# EasyEDA Pro project 高速USB.epro

# Schematic Schematic1

## Sheets
1 P1: Board Name: Board1; Create Date: 2025-02-11; Page Name: P1; Project Name: 高速USB; Schematic Name: Schematic1; Update Date: 2025-02-21; Company: 嘉立创EDA; Page Size: A4; Version: V1.0
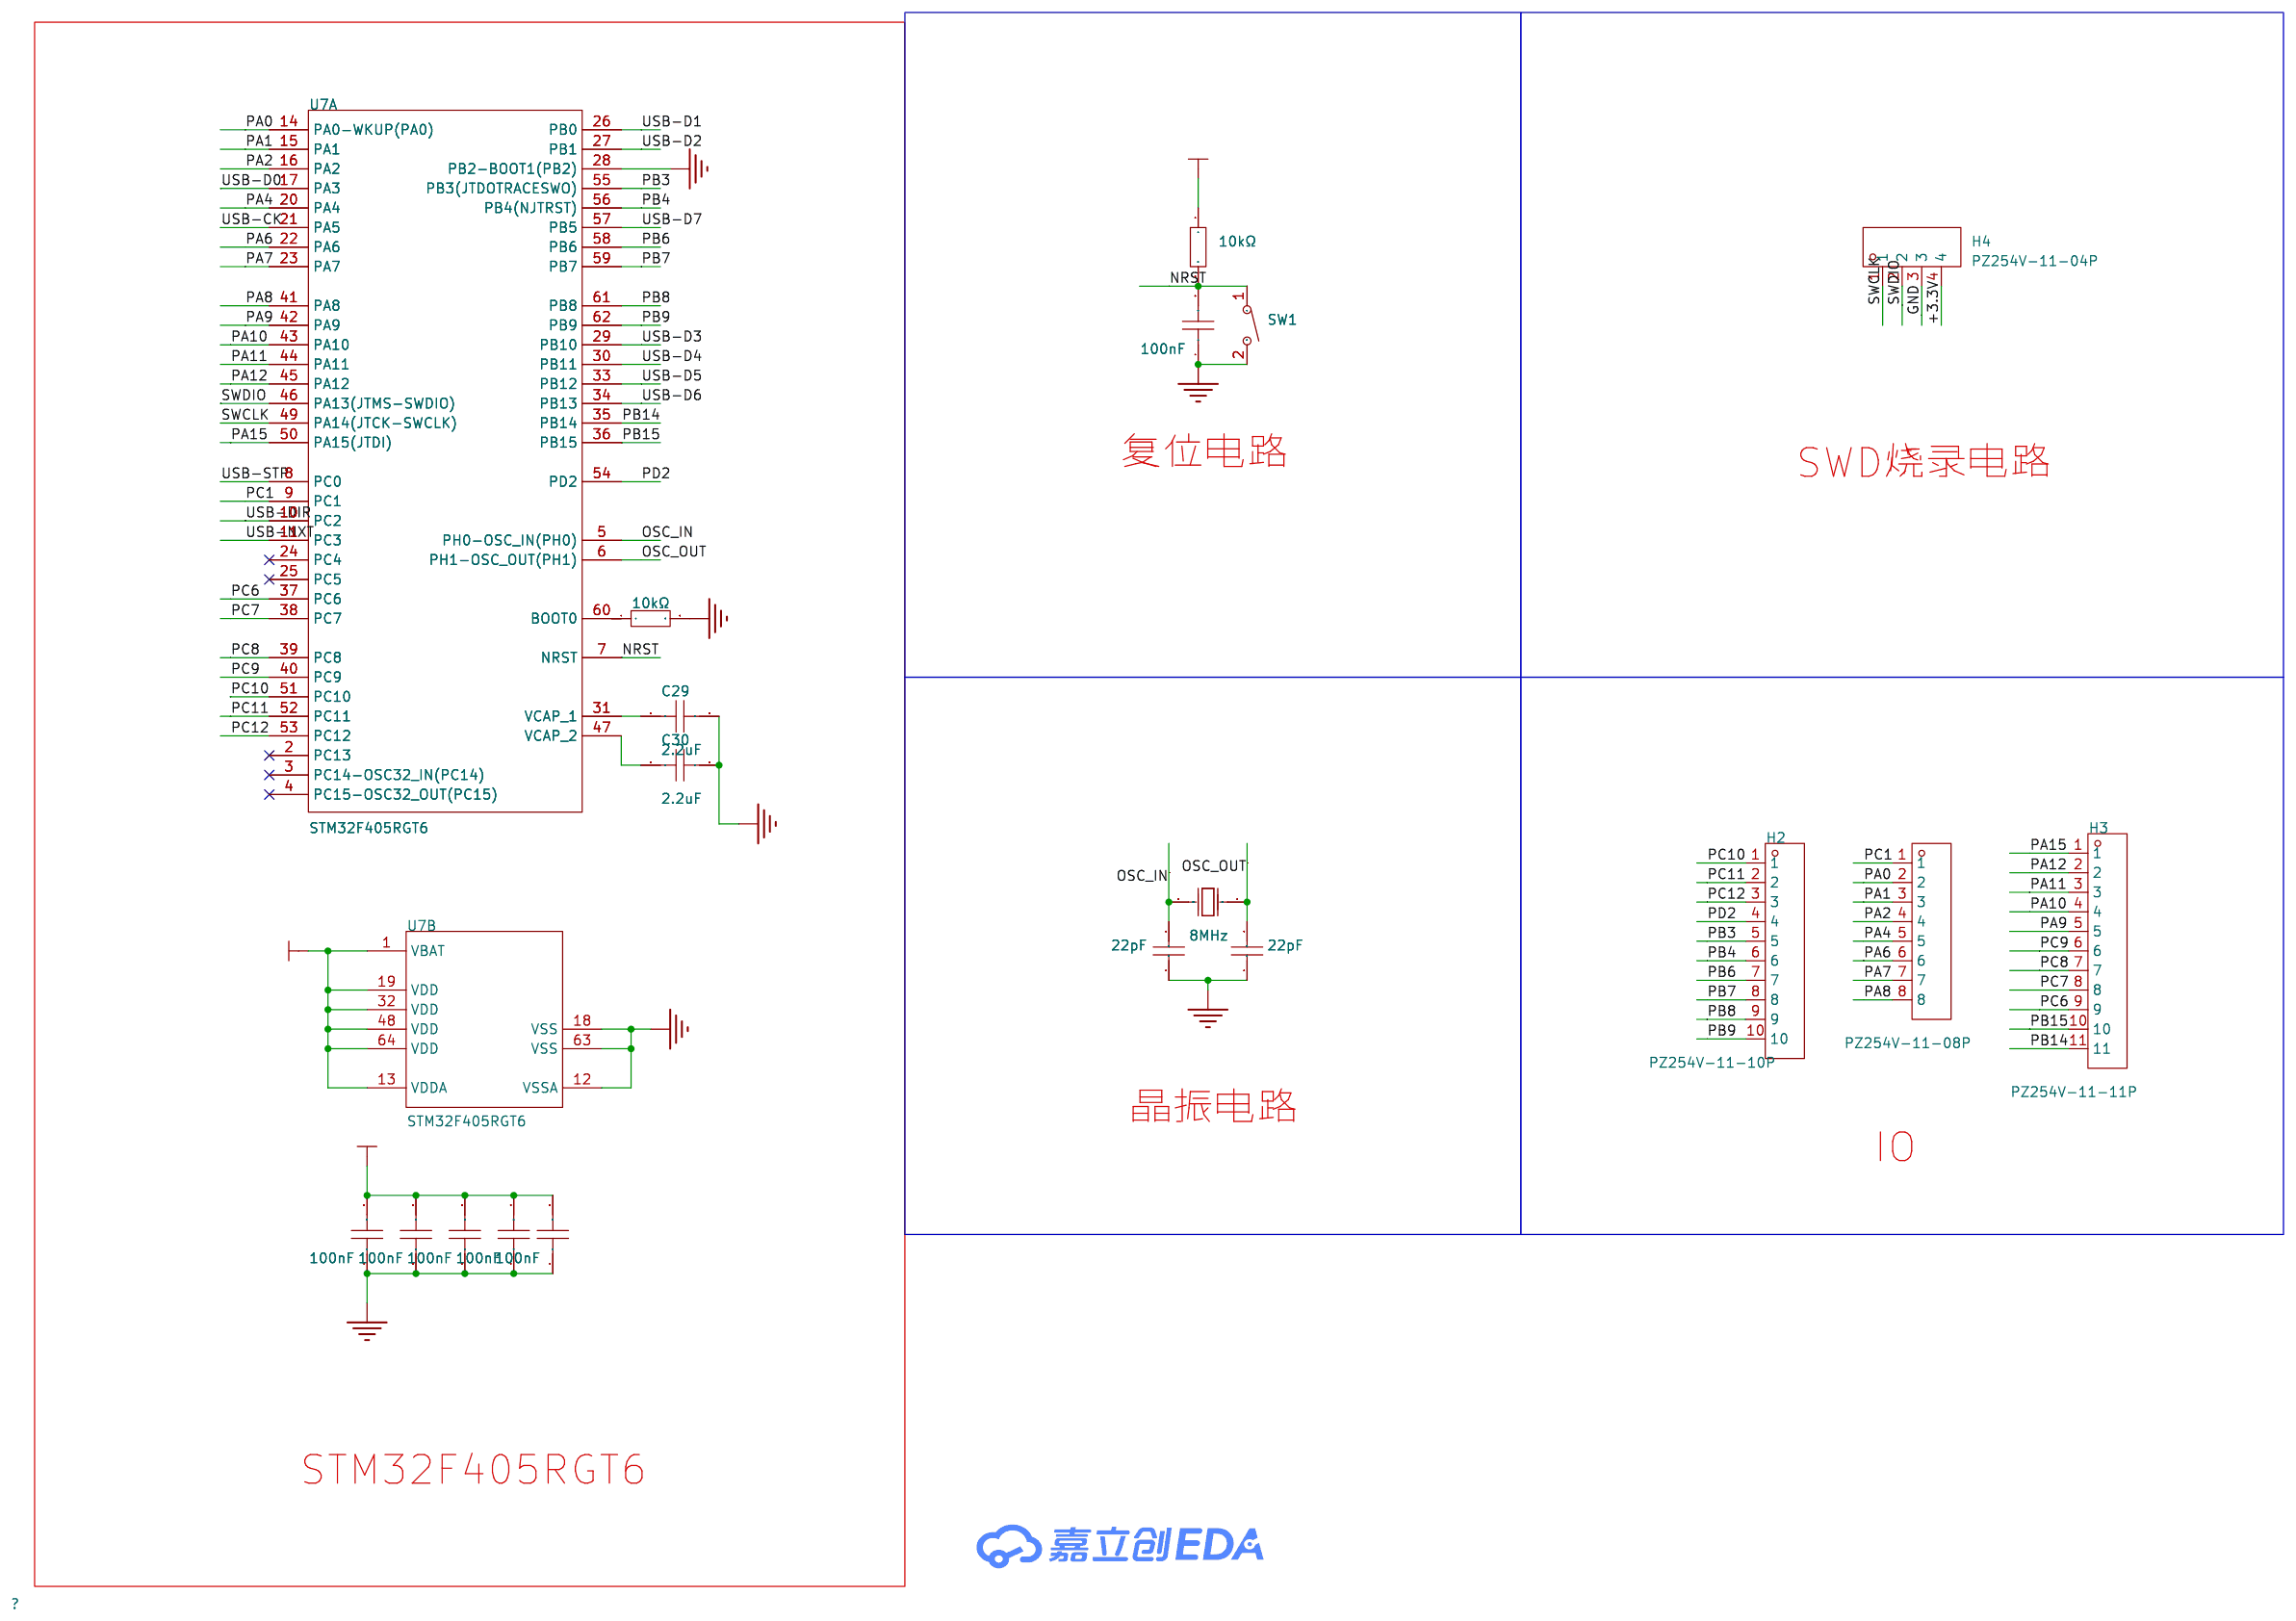
[diagram p0: P1]
2 P2: Page Name: P2
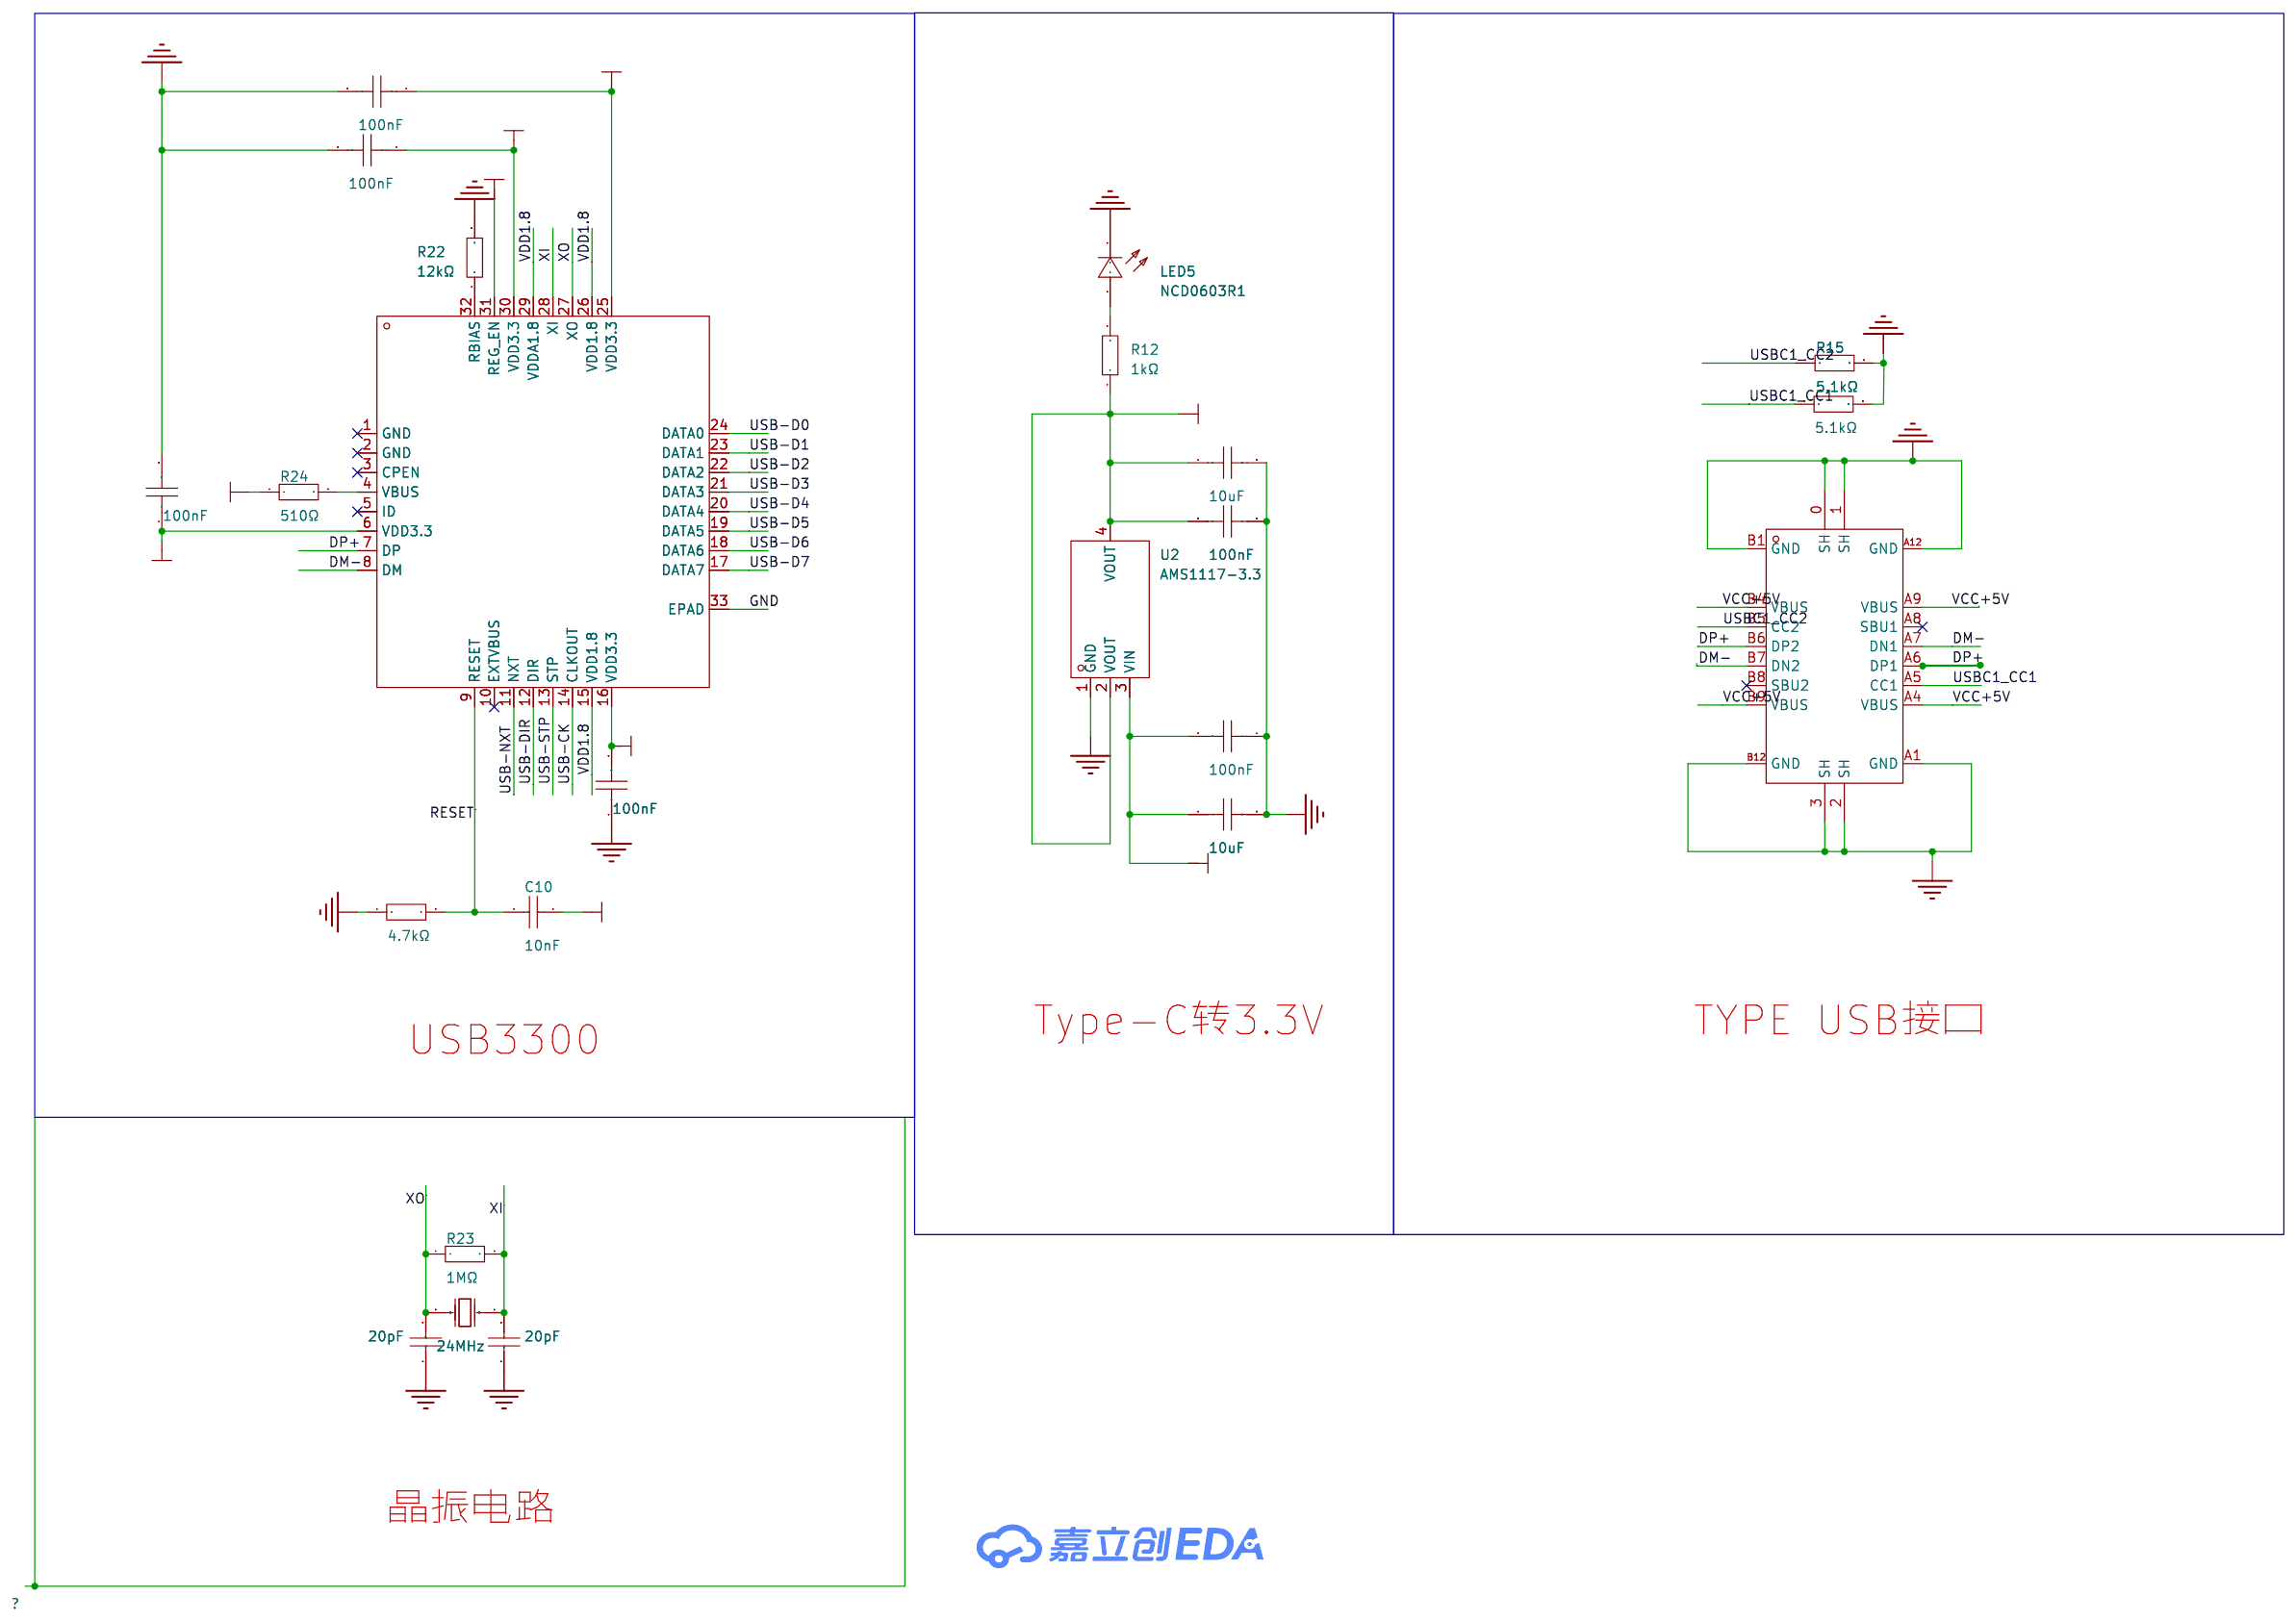
[diagram p1: P2]

## Parts
sheet P1
C20  22pF  [C0603]
C21  22pF  [C0603]
C22  100nF  [C0603]
C29  2.2uF  [C0603]
C30  2.2uF  [C0603]
C35  100nF  [C0603]
C36  100nF  [C0603]
C37  100nF  [C0603]
C38  100nF  [C0603]
C39  100nF  [C0603]
H1  PZ254V-11-08P  [HDR-TH_8P-P2.54-V-M]
H2  PZ254V-11-10P  [HDR-TH_10P-P2.54-V-M]
H3  PZ254V-11-11P  [HDR-TH_11P-P2.54-V-M]
H4  PZ254V-11-04P  [HDR-TH_4P-P2.54-V-M]
R18  10kΩ  [R0603]
R19  10kΩ  [R0603]
SW1  TS-1092S-B3D2-G  [SW-SMD_L6.1-W3.6-LS7.9]
U7  STM32F405RGT6  [LQFP-64_L10.0-W10.0-P0.50-LS12.0-BL]  (sections 1,2)
X3  8MHz  [OSC-SMD_L5.0-W3.2]
sheet P2
C10  10nF  [C0603]
C11  10uF  [C0603]
C12  100nF  [C0603]
C13  100nF  [C0603]
C14  10uF  [C0603]
C23  20pF  [C0603]
C24  20pF  [C0603]
C31  100nF  [C0603]
C32  100nF  [C0603]
C33  100nF  [C0603]
C34  100nF  [C0603]
LED5  NCD0603R1  [LED0603-RD_RED]
R11  4.7kΩ  [R0603]
R12  1kΩ  [R0603]
R14  5.1kΩ  [R0603]
R15  5.1kΩ  [R0603]
R22  12kΩ  [R0603]
R23  1MΩ  [R0603]
R24  510Ω  [R0603]
U2  AMS1117-3.3  [SOT-223-3_L6.5-W3.4-P2.30-LS7.0-BR]
USB3301  USB3300-EZK-TR  [QFN-32_L5.0-W5.0-P0.50-BL-EP3.4]
USBC2  TYPE-C-31-M-12  [USB-C_SMD-TYPE-C-31-M-12]
X4  24MHz  [HC-49US_L11.5-W4.5-P4.88]

## Library data of the parts
C20 C21 = CL10C220JB8NNNC: 容值:22pF;精度:±5%;额定电压:50V;材质(温度系数):C0G;; LCSC Part Name: 22pF ±5% 50V; Supplier Part: C1653; Manufacturer: SAMSUNG(三星); Supplier Footprint: 0603; Datasheet: https://atta.szlcsc.com/upload/public/pdf/source/20160218/1457707763339.pdf; Supplier: LCSC; Tolerance: ±5%; Voltage Rated: 50V; Temperature Coefficient: C0G
C12 C13 C22 C31-C39 = CGA0603X7R104K500JT: 容值:100nF;精度:±10%;额定电压:50V;材质(温度系数):X7R;; LCSC Part Name: 100nF ±10% 50V; Supplier Part: C6119867; Manufacturer: HRE(芯声); Supplier Footprint: 0603; Supplier: LCSC; Tolerance: ±10%; Voltage Rated: 50V; Temperature Coefficient: X7R
C29 C30 = CL10A225KB8NNNC: 容值:2.2uF;精度:±10%;额定电压:50V;材质(温度系数):X5R;; LCSC Part Name: 2.2uF ±10% 50V; Supplier Part: C913904; Manufacturer: SAMSUNG(三星); Supplier Footprint: 0603; JLCPCB Part Class: 扩展库; Datasheet: https://atta.szlcsc.com/upload/public/pdf/source/20160218/1457707763339.pdf; Supplier: LCSC; Tolerance: ±10%; Voltage Rated: 50V; Temperature Coefficient: X5R
H1 = PZ254V-11-08P: 插针结构:1x8P;间距:2.54mm;行距:-;圆针/方针:方针;安装类型:直插;排数:单排;总PIN位数:8P;额定电流:-;额定电压:-;配合针长度:6mm;塑高:2.5mm;端接针长度:3mm;触头材质:黄铜;触头镀层:-;工作温度范围:-40℃~+105℃;颜色:黑色;; LCSC Part Name: 间距:2.54mm 1x8P 直插 方针; Supplier Part: C492407; Manufacturer: XFCN(兴飞); Supplier Footprint: 插件,P=2.54mm; Datasheet: https://atta.szlcsc.com/upload/public/pdf/source/20200309/C492407_83A6FB26A2233368EDB9516968EC6149.pdf; Supplier: LCSC; Pin Structure: 1x8P; Pitch: 2.54mm; Circluar Pins/Square Pins: 方针; Mounting Type: 直插; Number of Rows: 单排; Number of Pins: 8P; Length of Mating Pin: 6mm; Insulation Height: 2.5mm; Length of End Connection Pin: 3mm; Contact Material: 黄铜; Operating Temperature Range: -40℃~+105℃; Color: 黑色
H2 = PZ254V-11-10P: 插针结构:1x10P;间距:2.54mm;行距:-;圆针/方针:方针;安装类型:直插;排数:单排;总PIN位数:10P;额定电流:-;额定电压:-;配合针长度:6mm;塑高:2.5mm;端接针长度:3mm;触头材质:黄铜;触头镀层:-;工作温度范围:-40℃~+105℃;颜色:黑色;; LCSC Part Name: 间距:2.54mm 1x10P 直插 方针; Supplier Part: C492409; Manufacturer: XFCN(兴飞); Supplier Footprint: 插件,P=2.54mm; Datasheet: https://atta.szlcsc.com/upload/public/pdf/source/20200309/C492409_129C9431BDD62EBBBD0A643B6AAB9FBD.pdf; Supplier: LCSC; Pin Structure: 1x10P; Pitch: 2.54mm; Circluar Pins/Square Pins: 方针; Mounting Type: 直插; Number of Rows: 单排; Number of Pins: 10P; Length of Mating Pin: 6mm; Insulation Height: 2.5mm; Length of End Connection Pin: 3mm; Contact Material: 黄铜; Operating Temperature Range: -40℃~+105℃; Color: 黑色
H3 = PZ254V-11-11P: 插针结构:1x11P;间距:2.54mm;行距:-;圆针/方针:方针;安装类型:直插;排数:单排;总PIN位数:11P;额定电流:3A;额定电压:250V;配合针长度:6mm;塑高:2.5mm;端接针长度:3mm;触头材质:-;工作温度范围:-40℃~+105℃;颜色:黑色;; LCSC Part Name: 间距:2.54mm 1x11P 直插 方针; Supplier Part: C2840011; Manufacturer: XFCN(兴飞); Supplier Footprint: 插件,P=2.54mm; Datasheet: https://atta.szlcsc.com/upload/public/pdf/source/20200309/C492403_F9F19131791D08044AD4F84F8E751A34.pdf; Supplier: LCSC; Pin Structure: 1x11P; Pitch: 2.54mm; Circluar Pins/Square Pins: 方针; Mounting Type: 直插; Number of Rows: 单排; Number of Pins: 11P; Current Rating (Max): 3A; Voltage Rating (Max): 250V; Length of Mating Pin: 6mm; Insulation Height: 2.5mm; Length of End Connection Pin: 3mm; Operating Temperature Range: -40℃~+105℃; Color: 黑色
H4 = PZ254V-11-04P: 插针结构:1x4P;间距:2.54mm;行距:-;圆针/方针:方针;安装类型:直插;排数:单排;总PIN位数:4P;额定电流:3A;额定电压:250V;配合针长度:6mm;塑高:2.5mm;端接针长度:3mm;触头材质:-;工作温度范围:-40℃~+105℃;颜色:黑色;; LCSC Part Name: 间距:2.54mm 1x4P 直插 方针; Supplier Part: C2691448; Manufacturer: XFCN(兴飞); Supplier Footprint: 插件,P=2.54mm; JLCPCB Part Class: 扩展库; Datasheet: https://atta.szlcsc.com/upload/public/pdf/source/20200309/C492403_F9F19131791D08044AD4F84F8E751A34.pdf; Supplier: LCSC; Pin Structure: 1x4P; Pitch: 2.54mm; Circluar Pins/Square Pins: 方针; Mounting Type: 直插; Number of Rows: 单排; Number of Pins: 4P; Current Rating (Max): 3A; Voltage Rating (Max): 250V; Length of Mating Pin: 6mm; Insulation Height: 2.5mm; Length of End Connection Pin: 3mm; Operating Temperature Range: -40℃~+105℃; Color: 黑色
R18 R19 = 0603WAF1002T5E: 电阻类型:厚膜电阻;阻值:10kΩ;精度:±1%;功率:100mW;最大工作电压:75V;温度系数:±100ppm/℃;; LCSC Part Name: 厚膜电阻 10kΩ ±1% 100mW; Supplier Part: C25804; Manufacturer: UNI-ROYAL(厚声); Supplier Footprint: 0603; Datasheet: https://atta.szlcsc.com/upload/public/pdf/source/20200306/C422600_1E6D84923E4A46A82E41ADD87F860B5C.pdf; Supplier: LCSC; Type: 厚膜电阻; Tolerance: ±1%; Power(Watts): 100mW; Overload Voltage (Max): 75V; Temperature Coefficient: ±100ppm/℃; Operating Temperature Range: -55℃~+155℃
SW1 = TS-1092S-B3D2-G: 电路结构:单刀单掷;按钮形状:矩形按钮;作用力:250gf;安装方式:立贴;开关长度:6.1mm;开关宽度:3.6mm;开关高度:2.5mm;带支架:不带;机械寿命:-;; LCSC Part Name: 6.1*3.6*2.5mm 立贴 轻触开关; Supplier Part: C520860; Manufacturer: Yuandi(元迪); Supplier Footprint: SMD; Datasheet: https://atta.szlcsc.com/upload/public/pdf/source/20200424/C520860_DA5AE47D9A9DC527FC720B5FF0895739.pdf; Supplier: LCSC; Circuit: 单刀单掷; Actuator Style: 矩形按钮; Operating Force: 250gf; Mounting Style: 立贴; Switch Length: 6.1mm; Switch Width: 3.6mm; Switch Height: 2.5mm; Strike Gundam: 不带; Actuator/Cap Color: 灰色; Pin Style: 鸥翼型
U7 = STM32F405RGT6: CPU内核:ARM-M4;CPU最大主频:168MHz;应用领域:-;; LCSC Part Name: 带DSP和FPU的高性能基础系列ARM Cortex-M4 MCU，具有1 MB Flash、168 MHz CPU和ART加速器; Supplier Part: C15742; Manufacturer: ST(意法半导体); Supplier Footprint: LQFP-64(10x10); JLCPCB Part Class: 扩展库; Datasheet: https://atta.szlcsc.com/upload/public/pdf/source/20140801/1457707197138.pdf; Supplier: LCSC; CPU Core: ARM-M4; CPU Maximum Speed: 168MHz; Program Storage Size: 1MB; Program Memory Type: FLASH; Number of I/O: 51; ADC (Bit): 12bit; DAC (Bit): 12bit; Low Voltage Detection Threshold: 1.8V~3.6V
X3 = TAXM8M2QLFCDT1T: 晶振类型:贴片晶振;频率:8MHz;常温频差:±30ppm;外接负载电容:20pF;频率稳定度(全温):±20ppm;; LCSC Part Name: 8MHz ±30ppm 20pF; Supplier Part: C122522; Manufacturer: YJX(雅晶鑫); Supplier Footprint: SMD5032; Datasheet: https://atta.szlcsc.com/upload/public/pdf/source/20220113/59EE8A0E7B9F67FF1BF3C454890DE4E5.pdf; Supplier: LCSC; Crystal Type: 贴片晶振; Normal temperature Frequency Tolerance: ±30ppm; External load capacitor: 20pF; Frequency Stability(Full temperature range): ±20ppm; Equivalent Series Resistance (ESR): 80Ω; Operating Temperature: -40℃~+85℃
C10 = CC0603KRX7R9BB103: 容值:10nF;精度:±10%;额定电压:50V;材质(温度系数):X7R;; LCSC Part Name: 10nF ±10% 50V; Supplier Part: C100042; Manufacturer: YAGEO(国巨); Supplier Footprint: 0603; Datasheet: https://atta.szlcsc.com/upload/public/pdf/source/20181008/C309510_22F155564471FAF6A489F7D68F34234E.pdf; Supplier: LCSC; Tolerance: ±10%; Voltage Rated: 50V; Temperature Coefficient: X7R
C11 C14 = CGA0603X5R106K100JT: 容值:10uF;精度:±10%;额定电压:10V;材质(温度系数):X5R;; LCSC Part Name: 10uF ±10% 10V; Supplier Part: C6119842; Manufacturer: HRE(芯声); Supplier Footprint: 0603; Supplier: LCSC; Tolerance: ±10%; Voltage Rated: 10V; Temperature Coefficient: X5R
C23 C24 = CL10C200JB8NNNC: 容值:20pF;精度:±5%;额定电压:50V;材质(温度系数):C0G;; LCSC Part Name: 20pF ±5% 50V; Supplier Part: C1648; Manufacturer: SAMSUNG(三星); Supplier Footprint: 0603; JLCPCB Part Class: 基础库; Datasheet: https://atta.szlcsc.com/upload/public/pdf/source/20160218/1457707763339.pdf; Supplier: LCSC; Tolerance: ±5%; Voltage Rated: 50V; Temperature Coefficient: C0G
LED5 = NCD0603R1_C84263: 灯头类型:-;发光颜色:红色;正向电压(VF):1.6V~2.6V;功率:65mW;正向电流:20mA;主波长:615nm~630nm;二极管配置:独立二极管;透镜颜色:无色透明透镜;色温:-;发光强度:80mcd~220mcd;发光角度:130°;载带方式:-;工作温度:-30℃~+85℃;; Supplier Part: C84263; Manufacturer: 国星光电; Supplier Footprint: 0603; JLCPCB Part Class: 扩展库; Datasheet: https://atta.szlcsc.com/upload/public/pdf/source/20200820/C84263_DABC6A75E58F576973B407FDBA283D60.pdf; Supplier: LCSC; Emitted Color: 红色; Forward Voltage (VF): 1.6V~2.6V; Power Dissipation: 65mW; Forward Current: 20mA; Dominant Wavelength: 615nm~630nm; Diode Configuration: 独立二极管; Lens Color: 无色透明透镜; Luminous Intensity: 80mcd~220mcd; Viewing Angle: 130°; Operating Temperature: -30℃~+85℃
R11 = 0603WAF4701T5E: 电阻类型:厚膜电阻;阻值:4.7kΩ;精度:±1%;功率:100mW;最大工作电压:75V;温度系数:±100ppm/℃;; LCSC Part Name: 4.7kΩ ±1% 100mW 厚膜电阻; Supplier Part: C23162; Manufacturer: UNI-ROYAL(厚声); Supplier Footprint: 0603; Datasheet: https://atta.szlcsc.com/upload/public/pdf/source/20200306/C422600_1E6D84923E4A46A82E41ADD87F860B5C.pdf; Supplier: LCSC; Type: 厚膜电阻; Tolerance: ±1%; Power(Watts): 100mW; Overload Voltage (Max): 75V; Temperature Coefficient: ±100ppm/℃; Operating Temperature Range: -55℃~+155℃
R12 = 0603WAF1001T5E: 电阻类型:厚膜电阻;阻值:1kΩ;精度:±1%;功率:100mW;最大工作电压:75V;温度系数:±100ppm/℃;; LCSC Part Name: 1kΩ ±1% 100mW 厚膜电阻; Supplier Part: C21190; Manufacturer: UNI-ROYAL(厚声); Supplier Footprint: 0603; Datasheet: https://atta.szlcsc.com/upload/public/pdf/source/20200306/C422600_1E6D84923E4A46A82E41ADD87F860B5C.pdf; Supplier: LCSC; Type: 厚膜电阻; Tolerance: ±1%; Power(Watts): 100mW; Overload Voltage (Max): 75V; Temperature Coefficient: ±100ppm/℃; Operating Temperature Range: -55℃~+155℃
R14 R15 = 0603WAF5101T5E: 电阻类型:厚膜电阻;阻值:5.1kΩ;精度:±1%;功率:100mW;最大工作电压:75V;温度系数:±100ppm/℃;; LCSC Part Name: 5.1kΩ ±1% 100mW 厚膜电阻; Supplier Part: C23186; Manufacturer: UNI-ROYAL(厚声); Supplier Footprint: 0603; Datasheet: https://atta.szlcsc.com/upload/public/pdf/source/20200306/C422600_1E6D84923E4A46A82E41ADD87F860B5C.pdf; Supplier: LCSC; Type: 厚膜电阻; Tolerance: ±1%; Power(Watts): 100mW; Overload Voltage (Max): 75V; Temperature Coefficient: ±100ppm/℃; Operating Temperature Range: -55℃~+155℃
R22 = 0603WAF1202T5E: 电阻类型:厚膜电阻;阻值:12kΩ;精度:±1%;功率:100mW;最大工作电压:75V;温度系数:±100ppm/℃;; LCSC Part Name: 12kΩ ±1% 100mW 厚膜电阻; Supplier Part: C22790; Manufacturer: UNI-ROYAL(厚声); Supplier Footprint: 0603; Datasheet: https://atta.szlcsc.com/upload/public/pdf/source/20200306/C422600_1E6D84923E4A46A82E41ADD87F860B5C.pdf; Supplier: LCSC; Type: 厚膜电阻; Tolerance: ±1%; Power(Watts): 100mW; Overload Voltage (Max): 75V; Temperature Coefficient: ±100ppm/℃; Operating Temperature Range: -55℃~+155℃
R23 = 0603WAF1004T5E: 电阻类型:厚膜电阻;阻值:1MΩ;精度:±1%;功率:100mW;最大工作电压:75V;温度系数:±100ppm/℃;; LCSC Part Name: 1MΩ ±1% 100mW 厚膜电阻; Supplier Part: C22935; Manufacturer: UNI-ROYAL(厚声); Supplier Footprint: 0603; JLCPCB Part Class: 基础库; Datasheet: https://atta.szlcsc.com/upload/public/pdf/source/20200306/C422600_1E6D84923E4A46A82E41ADD87F860B5C.pdf; Supplier: LCSC; Type: 厚膜电阻; Tolerance: ±1%; Power(Watts): 100mW; Overload Voltage (Max): 75V; Temperature Coefficient: ±100ppm/℃; Operating Temperature Range: -55℃~+155℃
R24 = 0603WAF5100T5E: 电阻类型:厚膜电阻;阻值:510Ω;精度:±1%;功率:100mW;最大工作电压:75V;温度系数:±100ppm/℃;; LCSC Part Name: 510Ω ±1% 100mW 厚膜电阻; Supplier Part: C23193; Manufacturer: UNI-ROYAL(厚声); Supplier Footprint: 0603; JLCPCB Part Class: 基础库; Datasheet: https://atta.szlcsc.com/upload/public/pdf/source/20200306/C422600_1E6D84923E4A46A82E41ADD87F860B5C.pdf; Supplier: LCSC; Type: 厚膜电阻; Tolerance: ±1%; Power(Watts): 100mW; Overload Voltage (Max): 75V; Temperature Coefficient: ±100ppm/℃; Operating Temperature Range: -55℃~+155℃
U2 = AMS1117-3.3_C6186: 输出类型:固定;最大输入电压:-;输出电压:3.3V;最大输出电流:1A;电源纹波抑制比(PSRR):72dB@(120Hz);输出极性:正极;; LCSC Part Name: 输出3.3V 1A; Supplier Part: C6186; Manufacturer: AMS; Supplier Footprint: SOT-223; Datasheet: https://atta.szlcsc.com/upload/public/pdf/source/20180727/C6186_7A095716F0823C02F1997A905E26C086.pdf; Supplier: LCSC; Output Type: 固定; Output Voltage: 3.3V; MAX Output Current: 1A; Power Supply Rejection Ratio (PSRR): 72dB@(120Hz); Dropout Voltage: 1.3V@(800mA); Output Polarity: 正极; Number of Outputs: 1
USB3301 = USB3300-EZK-TR: 应用功能:控制器;接口协议:-;; LCSC Part Name: 高速USB主机、设备或OTG PHY，带ULPI低引脚接口; Supplier Part: C108383; Manufacturer: MICROCHIP(美国微芯); Supplier Footprint: QFN-32-EP(5x5); JLCPCB Part Class: 扩展库; Datasheet: https://atta.szlcsc.com/upload/public/pdf/source/20170620/1497944729272.pdf; Supplier: LCSC; Applications Function: 控制器; Supply Voltage: 3V~3.6V; Operating Temperature: -40℃~+85℃
USBC2 = TYPE-C-31-M-12: 连接器类型:Type-C;标准:-;公母:母;安装方式:-;触点数量:16P;端口数量:1;额定电流 - 电源:5A;工作温度范围:-;; LCSC Part Name: Type-C 母; Supplier Part: C165948; Manufacturer: 韩国韩荣; Supplier Footprint: SMD; Datasheet: https://atta.szlcsc.com/upload/public/pdf/source/20220525/466408E853115E789EDB0DDC29077C05.pdf; Supplier: LCSC; Connector Type: Type-C; Gender: 母; Number of Contacts: 16P; Number of Ports: 1; Current Rating - Power (Max): 5A
X4 = X49SD24MSD2SC: 晶振类型:直插晶振;频率:24MHz;常温频差:±20ppm;外接负载电容:20pF;频率稳定度(全温):±30ppm;; LCSC Part Name: 24MHz ±20ppm 20pF; Supplier Part: C2213; Manufacturer: YXC(扬兴晶振); Supplier Footprint: HC-49S; JLCPCB Part Class: 扩展库; Datasheet: https://atta.szlcsc.com/upload/public/pdf/source/20240329/977D7F2434F98B2BE33270BB9FF3D86D.pdf; Supplier: LCSC; Crystal Type: 直插晶振; Normal temperature Frequency Tolerance: ±20ppm; External load capacitor: 20pF; Frequency Stability(Full temperature range): ±30ppm; Operating Temperature: -20℃~+70℃

## Nets
+3.3V: C10.2 C13.2 C14.1 C31.2 C32.1 C33.1 C34.1 C35.2 C36.2 C37.2 C38.2 C39.2 H4.4 R12.1 R19.1 U2.2(VOUT) U2.4(VOUT) U7.1(VBAT) U7.13(VDDA) U7.19(VDD) U7.32(VDD) U7.48(VDD) U7.64(VDD) USB3301.6(VDD3.3) USB3301.16(VDD3.3) USB3301.25(VDD3.3) USB3301.30(VDD3.3) USB3301.31(REG_EN)
GND: C11.2 C12.1 C13.1 C14.2 C20.1 C21.1 C22.1 C23.1 C24.1 C29.2 C30.2 C31.1 C32.2 C33.2 C34.2 C35.1 C36.1 C37.1 C38.1 C39.1 H4.3 LED5.1(K) R11.1 R15.2 R18.2 R22.2 SW1.2 U2.1(GND) U7.12(VSSA) U7.18(VSS) U7.28(PB2-BOOT1(PB2)) U7.63(VSS) USB3301.33(EPAD) USBC2.0(SH) USBC2.1(SH) USBC2.2(SH) USBC2.3(SH) USBC2.A1(GND) USBC2.A12(GND) USBC2.B1(GND) USBC2.B12(GND)
VCC+5V: C11.1 C12.2 R24.1 U2.3(VIN) USBC2.A4(VBUS) USBC2.A9(VBUS) USBC2.B4(VBUS) USBC2.B9(VBUS)
VDD1.8: USB3301.15(VDD1.8) USB3301.26(VDD1.8) USB3301.29(VDDA1.8)
DM-: USB3301.8(DM) USBC2.A7(DN1) USBC2.B7(DN2)
DP+: USB3301.7(DP) USBC2.A6(DP1) USBC2.B6(DP2)
NRST: C22.2 R19.2 SW1.1 U7.7(NRST)
OSC_IN: C20.2 U7.5(PH0-OSC_IN(PH0)) X3.2(OSC2)
OSC_OUT: C21.2 U7.6(PH1-OSC_OUT(PH1)) X3.1(OSC1)
PA0: H1.2 U7.14(PA0-WKUP(PA0))
PA1: H1.3 U7.15(PA1)
PA2: H1.4 U7.16(PA2)
PA4: H1.5 U7.20(PA4)
PA6: H1.6 U7.22(PA6)
PA7: H1.7 U7.23(PA7)
PA8: H1.8 U7.41(PA8)
PA9: H3.5 U7.42(PA9)
PA10: H3.4 U7.43(PA10)
PA11: H3.3 U7.44(PA11)
PA12: H3.2 U7.45(PA12)
PA15: H3.1 U7.50(PA15(JTDI))
PB3: H2.5 U7.55(PB3(JTDOTRACESWO))
PB4: H2.6 U7.56(PB4(NJTRST))
PB6: H2.7 U7.58(PB6)
PB7: H2.8 U7.59(PB7)
PB8: H2.9 U7.61(PB8)
PB9: H2.10 U7.62(PB9)
PB14: H3.11 U7.35(PB14)
PB15: H3.10 U7.36(PB15)
PC1: H1.1 U7.9(PC1)
PC6: H3.9 U7.37(PC6)
PC7: H3.8 U7.38(PC7)
PC8: H3.7 U7.39(PC8)
PC9: H3.6 U7.40(PC9)
PC10: H2.1 U7.51(PC10)
PC11: H2.2 U7.52(PC11)
PC12: H2.3 U7.53(PC12)
PD2: H2.4 U7.54(PD2)
RESET: C10.1 R11.2 USB3301.9(RESET)
SWCLK: H4.1 U7.49(PA14(JTCK-SWCLK))
SWDIO: H4.2 U7.46(PA13(JTMS-SWDIO))
USB-CK: U7.21(PA5) USB3301.14(CLKOUT)
USB-D0: U7.17(PA3) USB3301.24(DATA0)
USB-D1: U7.26(PB0) USB3301.23(DATA1)
USB-D2: U7.27(PB1) USB3301.22(DATA2)
USB-D3: U7.29(PB10) USB3301.21(DATA3)
USB-D4: U7.30(PB11) USB3301.20(DATA4)
USB-D5: U7.33(PB12) USB3301.19(DATA5)
USB-D6: U7.34(PB13) USB3301.18(DATA6)
USB-D7: U7.57(PB5) USB3301.17(DATA7)
USB-DIR: U7.10(PC2) USB3301.12(DIR)
USB-NXT: U7.11(PC3) USB3301.11(NXT)
USB-STP: U7.8(PC0) USB3301.13(STP)
USBC1_CC1: R14.1 USBC2.A5(CC1)
USBC1_CC2: R15.1 USBC2.B5(CC2)
XI: C23.2 R23.2 USB3301.28(XI) X4.1(OSC1)
XO: C24.2 R23.1 USB3301.27(XO) X4.2(OSC2)
$1N10874: R18.1 U7.60(BOOT0)
$1N11009: C29.1 U7.31(VCAP_1)
$1N13824: C30.1 U7.47(VCAP_2)
$2N2860: R24.2 USB3301.4(VBUS)
$2N7992: R22.1 USB3301.32(RBIAS)
$2N8222: LED5.2(A) R12.2

Not connected (* = marked no-connect by the designer): R14 2; U7 2(PC13)* 3(PC14-OSC32_IN(PC14))* 4(PC15-OSC32_OUT(PC15))* 24(PC4)* 25(PC5)*; USB3301 1(GND)* 2(GND)* 3(CPEN)* 5(ID)* 10(EXTVBUS)*; USBC2 A8(SBU1)* B8(SBU2)*

## Notes on the sheets
sheet 1
- 复位电路
- SWD烧录电路
- 晶振电路
- IO
- STM32F405RGT6
sheet 2
- Type-C转3.3V
- TYPE USB接口
- USB3300
- 晶振电路

# Board PCB1
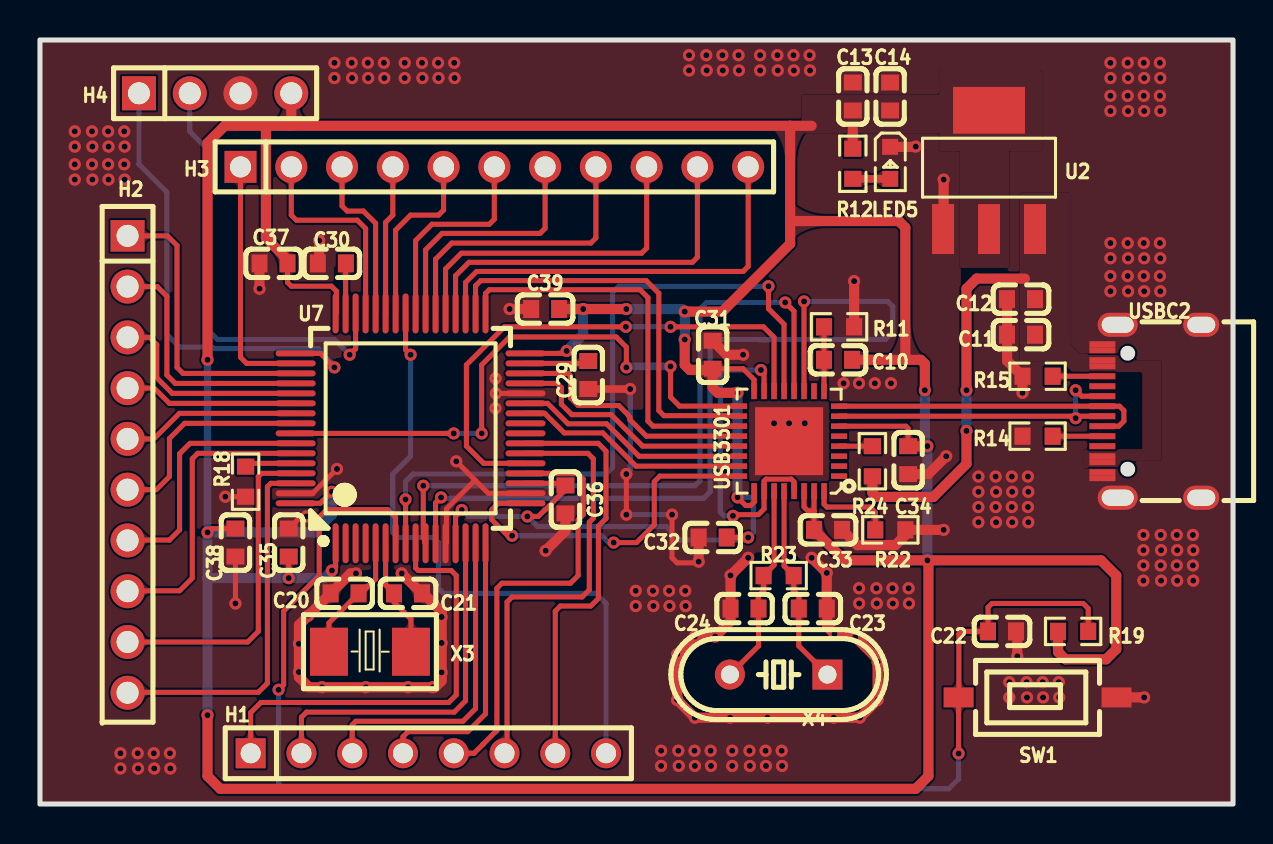
[diagram p2: board, top side]
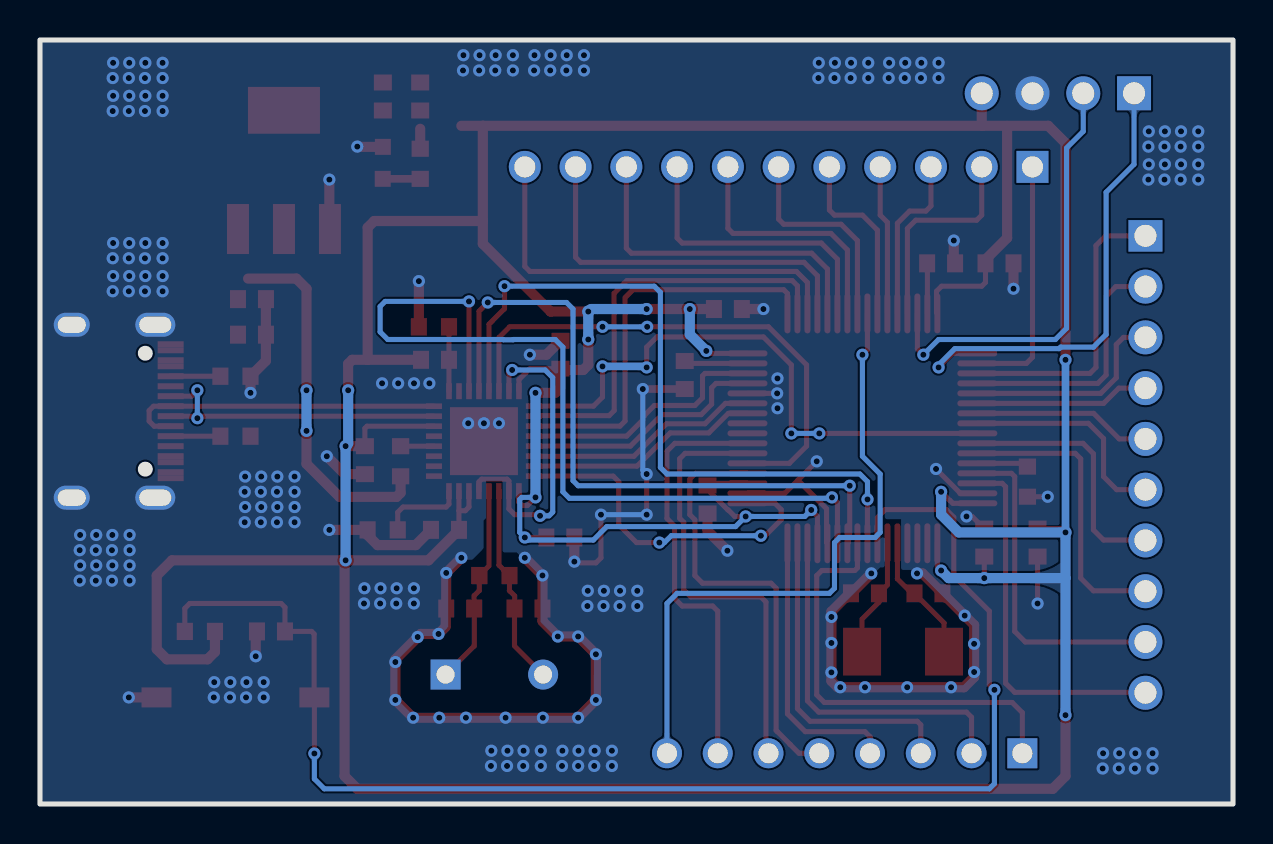
[diagram p3: board, bottom side, seen from below]

Outline 59.69 x 38.23 mm; copper layers: Top Layer, Bottom Layer. Coordinates in mm from the lower left corner of the outline.
Outline path: rectangle 0,38.23 59.69,0
Stack: Top Layer 0.035mm / Dielectric1 1.51mm FR4 er 4.5 / Bottom Layer 0.035mm

## Design rules (mm)
net DM-: DP1
net DP+: DP1
template: 自定义配置
spacing copperThickness1oz (default): track to track 0.203, other pairs 0.051 to 0.3
spacing copperThickness2oz: track to track 0.203, other pairs 0.152 to 0.3
track width copperThickness1oz (default): min 0.127, default 0.254, max 0.381
track width VCC: min 0.254, default 0.508, max 2.54
differential pair differentialPair (default): width min 0.127, default 0.254, max 2.54; gap min 0.152, default 0.152
via viaSize (default): diameter min 0.5, default 0.61, max 10; hole min 0.3, default 0.305, max 6.299
net +3.3V uses VCC
net GND uses VCC
net VCC+5V uses VCC
net VDD1.8 uses VCC

## Placement (name value [footprint] x y rotation side)
C10  10nF  [C0603]  39.93 22.22 0 top
C11  10uF  [C0603]  49.08 23.48 180 top
C12  100nF  [C0603]  49.08 25.26 0 top
C13  100nF  [C0603]  40.67 35.4 270 top
C14  10uF  [C0603]  42.53 35.4 90 top
C20  22pF  [C0603]  15.24 10.54 0 top
C21  22pF  [C0603]  18.42 10.54 180 top
C22  100nF  [C0603]  48.13 8.64 180 top
C23  20pF  [C0603]  38.66 9.78 180 top
C24  20pF  [C0603]  35.25 9.78 0 top
C29  2.2uF  [C0603]  27.43 21.46 270 top
C30  2.2uF  [C0603]  14.61 27.05 180 top
C31  100nF  [C0603]  33.65 22.48 270 top
C32  100nF  [C0603]  33.65 13.34 180 top
C33  100nF  [C0603]  39.43 13.72 0 top
C34  100nF  [C0603]  43.43 17.2 270 top
C35  100nF  [C0603]  12.45 13.08 270 top
C36  100nF  [C0603]  26.29 15.24 90 top
C37  100nF  [C0603]  11.68 27.05 0 top
C38  100nF  [C0603]  9.78 13.08 90 top
C39  100nF  [C0603]  25.27 24.77 0 top
H1  PZ254V-11-08P  [HDR-TH_8P-P2.54-V-M]  19.43 2.54 0 top
H2  PZ254V-11-10P  [HDR-TH_10P-P2.54-V-M]  4.38 17 270 top
H3  PZ254V-11-11P  [HDR-TH_11P-P2.54-V-M]  22.73 31.88 0 top
H4  PZ254V-11-04P  [HDR-TH_4P-P2.54-V-M]  8.76 35.56 0 top
LED5  NCD0603R1  [LED0603-RD_RED]  42.54 32.08 270 top
R11  4.7kΩ  [R0603]  39.98 23.88 180 top
R12  1kΩ  [R0603]  40.67 32.03 270 top
R14  5.1kΩ  [R0603]  49.91 18.4 180 top
R15  5.1kΩ  [R0603]  49.91 21.4 180 top
R18  10kΩ  [R0603]  10.29 16.13 270 top
R19  10kΩ  [R0603]  51.69 8.64 0 top
R22  12kΩ  [R0603]  42.55 13.72 0 top
R23  1MΩ  [R0603]  36.96 11.43 0 top
R24  510Ω  [R0603]  41.65 17.15 90 top
SW1  TS-1092S-B3D2-G  [SW-SMD_L6.1-W3.6-LS7.9]  49.91 5.33 0 top
U2  AMS1117-3.3  [SOT-223-3_L6.5-W3.4-P2.30-LS7.0-BR]  47.48 31.74 270 top
U7  STM32F405RGT6  [LQFP-64_L10.0-W10.0-P0.50-LS12.0-BL]  18.54 18.8 0 top
USB3301  USB3300-EZK-TR  [QFN-32_L5.0-W5.0-P0.50-BL-EP3.4]  37.48 18.16 90 top
USBC2  TYPE-C-31-M-12  [USB-C_SMD-TYPE-C-31-M-12]  55.63 19.65 90 top
X3  8MHz  [OSC-SMD_L5.0-W3.2]  16.51 7.62 180 top
X4  24MHz  [HC-49US_L11.5-W4.5-P4.88]  36.96 6.48 180 top

## Footprints (pads in the part's own frame, mm; a bottom-side part is the same pattern mirrored in y, then rotated)
C0603
  rect 0.8x0.9 smd: 1(-0.7,0) 2(0.7,0)
HC-49US_L11.5-W4.5-P4.88
  rect 1.5x1.5 hole 0.9: 1(-2.44,0)
  round 1.5 hole 0.9: 2(2.44,0)
HDR-TH_4P-P2.54-V-M
  rect 1.7x1.7 hole 1.1: 1(-3.81,0)
  round 1.7 hole 1.1: 2(-1.27,0) 3(1.27,0) 4(3.81,0)
HDR-TH_8P-P2.54-V-M
  rect 1.5x1.5 hole 1: 1(-8.89,0)
  round 1.5 hole 1: 2(-6.35,0) 3(-3.81,0) 4(-1.27,0) 5(1.27,0) 6(3.81,0) 7(6.35,0) 8(8.89,0)
HDR-TH_10P-P2.54-V-M
  rect 1.575x1.7 hole 1.1: 1(-11.43,0)
  round 1.7 hole 1.1: 2(-8.89,0) 3(-6.35,0) 4(-3.81,0) 5(-1.27,0) 6(1.27,0) 7(3.81,0) 8(6.35,0) 9(8.89,0) 10(11.43,0)
HDR-TH_11P-P2.54-V-M
  rect 1.6x1.6 hole 1.05: 1(-12.7,0)
  round 1.6 hole 1.05: 2(-10.16,0) 3(-7.62,0) 4(-5.08,0) 5(-2.54,0) 6(0,0) 7(2.54,0) 8(5.08,0) 9(7.62,0) 10(10.16,0) 11(12.7,0)
LED0603-RD_RED
  rect 0.8x0.8 smd: 1(-0.799,-0.004) 2(0.799,0.004)
LQFP-64_L10.0-W10.0-P0.50-LS12.0-BL
  oval 0.3x2 smd: 1(-3.75,-5.75) 2(-3.25,-5.75) 3(-2.75,-5.75) 4(-2.25,-5.75) 5(-1.75,-5.75) 6(-1.25,-5.75) 7(-0.75,-5.75) 8(-0.25,-5.75) 9(0.25,-5.75) 10(0.75,-5.75) 11(1.25,-5.75) 12(1.75,-5.75) 13(2.25,-5.75) 14(2.75,-5.75) 15(3.25,-5.75) 16(3.75,-5.75) 33(3.75,5.75) 34(3.25,5.75) 35(2.75,5.75) 36(2.25,5.75) 37(1.75,5.75) 38(1.25,5.75) 39(0.75,5.75) 40(0.25,5.75) 41(-0.25,5.75) 42(-0.75,5.75) 43(-1.25,5.75) 44(-1.75,5.75) 45(-2.25,5.75) 46(-2.75,5.75) 47(-3.25,5.75) 48(-3.75,5.75)
  oval 2x0.3 smd: 17(5.75,-3.75) 18(5.75,-3.25) 19(5.75,-2.75) 20(5.75,-2.25) 21(5.75,-1.75) 22(5.75,-1.25) 23(5.75,-0.75) 24(5.75,-0.25) 25(5.75,0.25) 26(5.75,0.75) 27(5.75,1.25) 28(5.75,1.75) 29(5.75,2.25) 30(5.75,2.75) 31(5.75,3.25) 32(5.75,3.75) 49(-5.75,3.75) 50(-5.75,3.25) 51(-5.75,2.75) 52(-5.75,2.25) 53(-5.75,1.75) 54(-5.75,1.25) 55(-5.75,0.75) 56(-5.75,0.25) 57(-5.75,-0.25) 58(-5.75,-0.75) 59(-5.75,-1.25) 60(-5.75,-1.75) 61(-5.75,-2.25) 62(-5.75,-2.75) 63(-5.75,-3.25) 64(-5.75,-3.75)
OSC-SMD_L5.0-W3.2
  rect 1.9x2.4 smd: 1(-2.05,0) 2(2.05,0)
QFN-32_L5.0-W5.0-P0.50-BL-EP3.4
  rect 0.28x0.8 smd: 1(-1.75,-2.5) 2(-1.252,-2.5) 3(-0.751,-2.5) 4(-0.252,-2.5) 5(0.248,-2.5) 6(0.749,-2.5) 7(1.248,-2.5) 8(1.748,-2.5) 17(1.752,2.5) 18(1.252,2.5) 19(0.751,2.5) 20(0.252,2.5) 21(-0.248,2.5) 22(-0.749,2.5) 23(-1.248,2.5) 24(-1.748,2.5)
  rect 0.8x0.28 smd: 9(2.5,-1.748) 10(2.5,-1.248) 11(2.5,-0.748) 12(2.5,-0.248) 13(2.5,0.252) 14(2.5,0.752) 15(2.5,1.252) 16(2.5,1.752) 25(-2.5,1.75) 26(-2.5,1.25) 27(-2.5,0.75) 28(-2.5,0.25) 29(-2.5,-0.25) 30(-2.5,-0.75) 31(-2.5,-1.25) 32(-2.5,-1.75)
  rect 3.4x3.4 smd: 33(0,0)
R0603
  rect 0.806x0.864 smd: 1(-0.753,0) 2(0.753,0)
SOT-223-3_L6.5-W3.4-P2.30-LS7.0-BR
  rect 2.5x1.1 smd: 1(2.97,-2.3) 2(2.97,0) 3(2.97,2.3)
  rect 2.34x3.6 smd: 4(-2.97,0)
SW-SMD_L6.1-W3.6-LS7.9
  rect 1.5x1 smd: 1(-3.95,0) 2(3.95,0)
USB-C_SMD-TYPE-C-31-M-12
  oval 1.2x2 hole 0.8x1.6: 0(-4.325,1.706) 1(4.325,1.706)
  oval 1.2x1.8 hole 0.8x1.4: 2(4.325,-2.474) 3(-4.325,-2.474)
  rect 0.3x1.3 smd: A1(-3.35,2.474) A4(-2.55,2.474) A5(-1.25,2.474) A6(-0.25,2.474) A7(0.25,2.474) A8(1.25,2.474) A9(2.55,2.474) A12(3.35,2.474) B1(3.05,2.474) B4(2.25,2.474) B5(1.75,2.474) B6(0.75,2.474) B7(-0.75,2.474) B8(-1.75,2.474) B9(-2.25,2.474) B12(-3.05,2.474)

## Nets
As in the schematic, except:
GND: C11.2 C12.1 C13.1 C14.2 C20.1 C21.1 C22.1 C23.1 C24.1 C29.2 C30.2 C31.1 C32.2 C33.2 C34.2 C35.1 C36.1 C37.1 C38.1 C39.1 H4.3 LED5.1 R11.1 R14.2 R15.2 R18.2 R22.2 SW1.2 U2.1 U7.12 U7.18 U7.28 U7.63 USB3301.33 USBC2.0 USBC2.1 USBC2.2 USBC2.3 USBC2.A1 USBC2.A12 USBC2.B1 USBC2.B12

Pads without a net: U7 2 3 4 24 25; USB3301 1 2 3 5 10; USBC2 A8 B8

## Via types
v1: diameter 0.61, hole 0.305, Top Layer to Bottom Layer, 267 vias

## Routing (per net, layer and track width the routed paths; a pad name or vN(x,y) marks a point on that pad's centre or on a via; arc(x,y) is an arc through that point)
+3.3V: length 268.3
  Top Layer w0.254: v1(34.9,15.34) 35.31,14.94 35.56,14.94 35.74,15.11 35.74,15.64 USB3301.25 ; v1(12.45,11.3) C35.2 ; USB3301.30 38.23,14.86 38.41,14.67 38.73,14.67 ; USB3301.6 43.33,18.9 43.43,18.8 C34.1 ; C37.2 12.38,26.1 12.57,25.91 14.58,25.91 14.83,25.65 14.83,24.59 U7.48 ; C38.2 8.57,13.78 v1(8.38,13.59) ; C31.2 35.18,21.78 35.73,21.23 USB3301.16 ; v1(26.35,22.67) 26.23,22.55 U7.32 ; U7.64 14.02,15.05 14.16,15.19 14.17,15.19 v1(14.61,15.62) ; v1(24.38,14.39) 24.93,14.39 25.26,14.72 25.28,14.72 26.29,15.73 C36.2 26.18,16.05 U7.19 ; v1(14.61,11.68) 14.79,11.87 U7.1 ; v1(21.1,14.71) 20.79,14.4 U7.13 ; 38.73,14.67 USB3301.31 ; 38.73,14.67 C33.1 ; v1(35.43,13.34) C32.1
  Top Layer w0.508: 44.45,12.14 44.45,1.4 43.82,0.76 9.02,0.76 8.38,1.4 v1(8.38,4.45) ; 12.54,33.93 9.24,33.93 8.38,33.07 v1(8.38,22.22) ; 12.54,33.93 37.53,33.93 ; 12.54,33.93 12.57,33.97 H4.4 ; v1(34.9,20.57) 33.91,20.57 33.65,20.83 C31.2 33.59,21.72 32.51,21.72 32.26,21.97 v1(32.26,23.24) ; 11.3,33.92 11.3,28.32 12.38,27.24 C37.2 ; 37.53,29.17 37.53,28.03 34.14,24.64 v1(32.26,24.64) ; 37.53,29.17 37.53,33.93 ; 37.53,29.17 42.97,29.17 43.3,28.84 43.3,22.22 ; v1(44.4,17.91) 44.39,17.9 C34.1 ; R12.1 40.67,33.78 ; 37.53,33.93 38.61,33.93 ; v1(29.34,24.77) v1(27.18,24.77) C39.2 ; 43.3,22.22 C10.2 ; 43.3,22.22 44.07,22.22 44.27,22.02 v1(44.27,20.7) ; C33.1 40.25,12.19 44.32,12.19 ; R19.1 50.94,7.61 51.31,7.24 53.34,7.24 53.85,7.75 53.85,11.43 53.09,12.19 v1(44.4,12.19)
  Bottom Layer w0.254: v1(21.1,14.71) 21.43,14.39 v1(24.38,14.39) 24.89,13.88 31.33,13.88 32,13.21 35.31,13.21 v1(35.43,13.34) 35.69,13.59 35.69,15.24 35.59,15.34 v1(34.9,15.34) ; 32.13,24.77 v1(32.26,24.64)
  Bottom Layer w0.381: v1(8.38,13.59) v1(8.38,22.22)
  Bottom Layer w0.508: v1(34.9,15.34) v1(34.9,20.57) ; v1(14.61,15.62) 14.61,14.48 13.72,13.59 v1(8.38,13.59) 8.38,11.3 ; v1(14.61,11.68) 14.22,11.3 v1(12.45,11.3) 8.38,11.3 ; v1(29.34,24.77) 32.13,24.77 ; v1(44.27,20.7) 44.27,18.03 v1(44.4,17.91) v1(44.4,12.19) ; v1(32.26,24.64) v1(32.26,23.24) ; v1(8.38,4.45) 8.38,11.3 ; v1(27.18,24.77) 27.18,23.5 v1(26.35,22.67)
GND: length 110.7
  Top Layer w0.254: U7.12 20.33,13.09 20.33,14.77 21.77,16.2 ; v1(13.33,14.39) 13.05,14.39 C35.1 ; U7.28 v1(22.81,20.55) ; 21.77,16.2 22.43,15.55 U7.18 ; 21.77,16.2 v1(20.83,17.14) ; C38.1 v1(9.78,10.03) ; v1(31.62,14.48) 31.62,12.32 31.88,12.06 32.89,12.06 v1(32.95,12.13) ; v1(14.86,16.76) 13.64,15.55 U7.63 ; v1(29.34,14.48) v1(29.34,16.51) ; R18.2 v1(9.27,15.38)
  Top Layer w0.381: C29.2 v1(29.53,20.76)
  Top Layer w0.508: C32.2 v1(32.95,12.13) ; v1(49.16,20.57) R15.2 48.39,22.17 48.39,25.26 C12.1 ; 43.43,16.5 44.44,16.5 v1(45.34,17.4) ; C36.1 26.29,13.67 v1(25.3,12.67) ; 10.98,27.05 v1(10.98,25.78) ; R11.1 v1(40.73,26.16) ; C33.2 40.89,12.95 42.8,12.95 43.3,13.45 R22.2 v1(45.21,13.72) ; U2.1 45.21,28.8 v1(45.21,31.24) ; C39.1 v1(23.49,24.77) ; v1(35.18,22.48) 34.36,22.48 C31.1 ; v1(38.61,12.32) v1(39.36,11.56) C23.1 39.39,9.75 39.39,8.87 v1(39.75,8.51) 40.64,8.51 41.91,7.24 v1(41.91,5.21) v1(41.02,4.32) v1(39.71,4.32) v1(38.38,4.32) v1(36.39,4.32) v1(34.53,4.32) v1(32.77,4.32) v1(31.88,5.21) v1(31.88,7.49) v1(32.77,8.38) v1(33.78,8.38) 34.55,9.15 C24.1 v1(34.55,11.44) v1(35.43,12.32) ; v1(43.82,32.89) 43.8,32.88 42.53,32.88 ; C30.2 13.97,27.12 v1(13.97,28.19) ; v1(18.1,11.54) 19.1,10.54 ; C21.1 19.18,10.54 20.09,9.62 v1(20.09,8.06) v1(20.09,6.59) 20.09,6.16 19.78,5.84 v1(19.65,5.84) v1(18.41,5.84) v1(16.3,5.84) v1(14.11,5.84) 13.46,5.84 12.95,6.35 v1(12.95,6.6) v1(12.95,8.02) 12.95,8.95 v1(13.43,9.43) C20.1 15.54,11.54 v1(15.81,11.54) ; SW1.2 v1(55.24,5.33) ; C22.1 48.89,8.57 v1(48.89,7.39)
  Bottom Layer w0.254: v1(29.34,14.48) v1(31.62,14.48) ; v1(29.53,20.76) 29.53,16.7 v1(29.34,16.51)
  vias: v1(1.74,33.66) v1(1.74,32.89) v1(1.74,32) v1(1.74,31.24) v1(2.6,33.66) v1(2.62,32.89) v1(2.6,32) v1(2.62,31.24) v1(3.41,33.66) v1(3.43,32.89) v1(3.41,32) v1(3.43,31.24) v1(4.03,2.54) v1(4.03,1.78) v1(4.22,33.66) v1(4.24,32.89) v1(4.22,32) v1(4.24,31.24) v1(4.89,2.54) v1(4.91,1.78) v1(5.69,2.54) v1(5.72,1.78) v1(6.5,2.54) v1(6.52,1.78) v1(14.73,37.08) v1(14.73,36.32) v1(15.6,37.08) v1(15.61,36.32) v1(16.4,37.08) v1(16.42,36.32) v1(17.21,37.08) v1(17.23,36.32) v1(18.25,37.08) v1(18.25,36.32) v1(19.11,37.08) v1(19.13,36.32) v1(19.92,37.08) v1(19.94,36.32) v1(20.09,9.36) v1(20.73,37.08) v1(20.75,36.32) v1(22.79,21.29) v1(22.79,19.8) v1(29.81,10.67) v1(29.81,9.91) v1(30.67,10.67) v1(30.69,9.91) v1(31.08,2.67) v1(31.08,1.91) v1(31.48,10.67) v1(31.5,9.91) v1(31.94,2.67) v1(31.96,1.91) v1(32.28,10.67) v1(32.3,9.91) v1(32.47,37.47) v1(32.47,36.7) v1(32.75,2.67) v1(32.77,1.91) v1(33.34,37.47) v1(33.36,36.7) v1(33.55,2.67) v1(33.57,1.91) v1(34.14,37.47) v1(34.16,36.7) v1(34.63,2.67) v1(34.63,1.91) v1(34.95,37.47) v1(34.97,36.7) v1(35.5,2.67) v1(35.52,1.91) v1(36.03,37.47) v1(36.03,36.7) v1(36.3,2.67) v1(36.32,1.91) v1(36.73,19.05) v1(36.89,37.47) v1(36.91,36.7) v1(37.11,2.67) v1(37.13,1.91) v1(37.48,19.05) v1(37.7,37.47) v1(37.72,36.7) v1(38.27,19.05) v1(38.51,37.47) v1(38.53,36.7) v1(40.21,21.05) v1(40.79,8.36) v1(40.98,21.05) v1(40.98,10.8) v1(40.98,10.03) v1(41.77,21.05) v1(41.85,10.8) v1(41.87,10.03) v1(41.91,7.1) v1(42.58,21.05) v1(42.65,10.8) v1(42.67,10.03) v1(43.46,10.8) v1(43.48,10.03) v1(46.95,16.38) v1(46.95,15.62) v1(46.95,14.86) v1(46.95,14.1) v1(47.81,16.38) v1(47.83,15.62) v1(47.81,14.86) v1(47.83,14.1) v1(48.5,6.1) v1(48.5,5.33) v1(48.62,16.38) v1(48.64,15.62) v1(48.62,14.86) v1(48.64,14.1) v1(49.36,6.1) v1(49.38,5.33) v1(49.43,16.38) v1(49.45,15.62) v1(49.43,14.86) v1(49.45,14.1) v1(50.17,6.1) v1(50.19,5.33) v1(50.97,6.1) v1(50.99,5.33) v1(53.56,37.08) v1(53.56,36.32) v1(53.56,35.43) v1(53.56,34.67) v1(53.56,28.07) v1(53.56,27.31) v1(53.56,26.42) v1(53.56,25.65) v1(54.42,37.08) v1(54.44,36.32) v1(54.42,35.43) v1(54.44,34.67) v1(54.42,28.07) v1(54.44,27.31) v1(54.42,26.42) v1(54.44,25.65) v1(55.23,37.08) v1(55.24,36.32) v1(55.23,35.43) v1(55.24,34.67) v1(55.23,28.07) v1(55.24,27.31) v1(55.23,26.42) v1(55.24,25.65) v1(55.21,13.46) v1(55.21,12.7) v1(55.21,11.94) v1(55.21,11.18) v1(56.03,37.08) v1(56.05,36.32) v1(56.03,35.43) v1(56.05,34.67) v1(56.03,28.07) v1(56.05,27.31) v1(56.03,26.42) v1(56.05,25.65) v1(56.07,13.46) v1(56.09,12.7) v1(56.07,11.94) v1(56.09,11.18) v1(56.88,13.46) v1(56.9,12.7) v1(56.88,11.94) v1(56.9,11.18) v1(57.68,13.46) v1(57.68,11.94) v1(57.7,12.7) v1(57.7,11.18)
VCC+5V: length 18.2
  Top Layer w0.508: R24.1 41.65,15.57 41.85,15.37 44.7,15.37 46.36,17.02 v1(46.36,18.67) ; v1(46.36,20.7) 46.36,25.78 46.86,26.29 49.28,26.29
  Bottom Layer w0.508: v1(46.36,20.7) v1(46.36,18.67)
VDD1.8: length 15.9
  Top Layer w0.254: USB3301.29 37.73,16.12 37.59,16.26 36.32,16.26 36.23,16.16 USB3301.26 36.23,14.77 35.94,14.48 34.73,14.48 v1(34.67,14.42) ; v1(36.07,21.72) 36.23,21.56 USB3301.15
  Bottom Layer w0.254: v1(36.07,21.72) 34.42,21.72 34.04,21.34 34.04,14.61 34.22,14.42 v1(34.67,14.42)
DM-: length 16.1
  Top Layer w0.254: USBC2.B7 53.98,18.9 54.23,19.16 54.23,19.69 54.01,19.9 USBC2.A7 USB3301.8
DP+: length 16
  Top Layer w0.254: USB3301.7 USBC2.A6 ; v1(51.82,20.7) 52.11,20.4 USBC2.B6
  Bottom Layer w0.254: v1(51.82,19.3) v1(51.82,20.7)
NRST: length 70.3
  Top Layer w0.254: R19.2 52.44,9.79 52.2,10.03 47.62,10.03 47.43,9.84 C22.2 46.1,8.64 45.97,8.51 45.97,5.35 SW1.1 v1(45.96,2.53) ; v1(11.94,5.72) 12.19,5.97 12.19,9.65 13.97,11.43 13.97,14.35 14.35,14.73 17.4,14.73 17.79,14.34 U7.7
  Bottom Layer w0.254: v1(45.96,2.53) 45.96,1.26 45.47,0.76 12.19,0.76 11.94,1.02 v1(11.94,5.72)
OSC_IN: length 6.5
  Top Layer w0.254: U7.5 16.79,11.27 16.07,10.54 C20.2 14.46,9.06 X3.2
OSC_OUT: length 6
  Top Layer w0.254: U7.6 17.29,10.96 C21.2 17.71,10.1 18.56,9.25 18.56,7.62
PA0: length 18.2
  Top Layer w0.254: U7.14 21.29,5.16 20.73,4.6 13.33,4.6 13.08,4.34 H1.2
PA1: length 16.2
  Top Layer w0.254: U7.15 21.79,4.77 21.16,4.14 15.8,4.14 15.62,3.96 H1.3
PA2: length 14
  Top Layer w0.254: U7.16 22.29,4.51 21.4,3.62 18.42,3.62 18.16,3.37 H1.4
PA4: length 22
  Top Layer w0.254: H1.5 21.72,2.54 22.16,2.98 22.16,2.99 22.79,3.62 22.8,3.62 22.86,3.68 22.86,10.8 23.11,11.05 26.54,11.05 26.92,11.43 26.92,14.22 27.18,14.48 27.18,16.26 26.89,16.55 U7.20
PA6: length 22.1
  Top Layer w0.254: H1.6 23.37,2.67 23.37,10.11 23.62,10.36 27.13,10.36 27.48,10.72 27.48,14.1 27.69,14.3 27.69,17.27 27.41,17.55 U7.22
PA7: length 21.2
  Top Layer w0.254: U7.23 27.93,18.05 28.32,17.65 28.32,14.29 27.94,13.91 27.94,10.29 27.56,9.91 26.04,9.91 25.78,9.65 H1.7
PA8: length 32.4
  Top Layer w0.254: U7.41 18.29,22.73 v1(18.54,22.48)
  Bottom Layer w0.254: v1(18.54,22.48) 18.54,17.4 17.65,16.51 17.65,13.59 17.91,13.34 19.68,13.34 19.94,13.08 19.94,10.8 20.19,10.54 27.81,10.54 28.32,10.03 H1.8
PA9: length 9.1
  Top Layer w0.254: H3.5 20.19,29.72 19.94,29.46 18.54,29.46 17.79,28.71 U7.42
PA10: length 7.5
  Top Layer w0.254: U7.43 17.29,29.1 17.65,29.46 H3.4
PA11: length 8.5
  Top Layer w0.254: U7.44 16.79,29.06 16.18,29.67 15.37,29.67 15.11,29.92 H3.3
PA12: length 10.7
  Top Layer w0.254: H3.2 12.57,29.46 12.83,29.21 15.87,29.21 16.29,28.79 U7.45
PA15: length 12.4
  Top Layer w0.254: H3.1 10.03,22.35 10.34,22.05 U7.50
PB3: length 8.9
  Top Layer w0.254: H2.5 5.69,18.27 6.97,19.55 U7.55
PB4: length 10.9
  Top Layer w0.254: U7.56 7.23,19.05 6.48,18.29 6.48,16.38 5.82,15.73 H2.6
PB6: length 12.7
  Top Layer w0.254: U7.58 7.51,18.05 6.98,17.53 6.98,13.72 6.48,13.21 4.4,13.21 H2.7
PB7: length 14.8
  Top Layer w0.254: U7.59 7.89,17.55 7.62,17.27 7.62,11.3 6.98,10.67 4.4,10.67 H2.8
PB8: length 16.4
  Top Layer w0.254: U7.61 11.08,16.55 10.92,16.38 10.92,8.64 10.39,8.11 H2.9
PB9: length 18.5
  Top Layer w0.254: H2.10 4.4,5.59 10.92,5.59 11.38,6.05 11.38,15.88 11.55,16.05 U7.62
PB14: length 21
  Top Layer w0.254: H3.11 35.43,26.9 35.18,26.64 21.84,26.64 21.29,26.09 U7.35
PB15: length 18.9
  Top Layer w0.254: U7.36 20.79,26.43 21.46,27.1 32.64,27.1 32.89,27.36 H3.10
PC1: length 22.1
  Top Layer w0.254: H1.1 10.54,4.57 11.05,5.08 20.45,5.08 20.83,5.46 20.83,11.43 20.57,11.68 18.92,11.68 18.79,11.81 U7.9
PC6: length 16.8
  Top Layer w0.254: H3.9 30.35,27.81 30.1,27.56 21.08,27.56 20.29,26.77 U7.37
PC7: length 14.7
  Top Layer w0.254: H3.8 27.81,28.32 27.56,28.07 20.6,28.07 19.79,27.26 U7.38
PC8: length 12.7
  Top Layer w0.254: U7.39 19.29,27.72 20.12,28.55 25.02,28.55 25.27,28.8 H3.7
PC9: length 10.6
  Top Layer w0.254: H3.6 22.73,29.26 22.48,29.01 19.61,29.01 18.79,28.19 U7.40
PC10: length 14.8
  Top Layer w0.254: U7.51 7.16,21.55 6.86,21.84 6.86,27.94 6.37,28.43 H2.1
PC11: length 12.7
  Top Layer w0.254: H2.2 5.86,25.89 6.35,25.4 6.35,21.46 6.77,21.05 U7.52
PC12: length 10.5
  Top Layer w0.254: H2.3 5.48,23.35 5.84,22.99 5.84,21.32 6.62,20.55 U7.53
PD2: length 8.7
  Top Layer w0.254: H2.4 5.71,20.81 6.47,20.05 U7.54
RESET: length 3.2
  Top Layer w0.254: R11.2 C10.1 USB3301.9
SWCLK: length 24
  Top Layer w0.254: U7.49 14.03,22.55 v1(14.73,21.84)
  Bottom Layer w0.254: v1(14.73,21.84) 14.73,21.97 13.92,22.78 8.7,22.78 8.62,22.86 6.98,22.86 6.35,23.5 6.35,30.61 4.95,32 H4.1
SWDIO: length 22
  Top Layer w0.254: U7.46 15.79,22.78 v1(15.49,22.48)
  Bottom Layer w0.254: v1(15.49,22.48) 14.73,23.24 8.89,23.24 8.33,23.8 8.33,32.82 7.49,33.66 H4.2
USB-CK: length 26.5
  Top Layer w0.254: v1(31.55,23.88) 36.2,23.88 36.73,23.34 USB3301.14 ; v1(29.31,23.88) 23.24,23.88 21.34,21.97 21.34,17.91 22.2,17.05 U7.21
  Bottom Layer w0.254: v1(29.31,23.88) v1(31.55,23.88)
USB-D0: length 17.8
  Top Layer w0.254: USB3301.24 31.01,16.41 30.73,16.13 30.73,13.97 29.85,13.08 v1(28.7,13.08) ; U7.17 22.92,15.05 22.61,14.73 22.61,14.22 23.41,13.42 v1(23.62,13.42)
  Bottom Layer w0.254: v1(23.62,13.42) 28.11,13.42 28.45,13.08 v1(28.7,13.08)
USB-D1: length 11.8
  Top Layer w0.254: U7.26 25.25,19.55 26.23,18.57 28.16,18.57 29.82,16.91 USB3301.23
USB-D2: length 11.8
  Top Layer w0.254: USB3301.22 34.97,17.4 29.97,17.4 28.35,19.02 26.42,19.02 25.4,20.05 U7.27
USB-D3: length 12.5
  Top Layer w0.254: U7.29 25.87,21.05 26.09,20.83 26.09,20 26.61,19.48 28.58,19.48 30.15,17.91 USB3301.21
USB-D4: length 12.7
  Top Layer w0.254: U7.30 26.42,21.55 26.54,21.42 26.54,20.32 26.92,19.94 28.96,19.94 29.44,19.46 29.44,19.43 29.52,19.36 29.52,19.23 30.34,18.41 USB3301.20
USB-D5: length 20.2
  Top Layer w0.254: USB3301.19 30.67,18.91 30.42,19.16 30.42,25.34 30.02,25.73 22.48,25.73 22.29,25.54 U7.33
USB-D6: length 20.9
  Top Layer w0.254: U7.34 21.79,25.93 22.05,26.19 30.33,26.19 30.96,25.55 30.96,19.69 31.22,19.43 34.95,19.43 USB3301.18
USB-D7: length 29.2
  Top Layer w0.254: v1(22.1,18.54) 22.1,21.97 23.49,23.37 28.83,23.37 29.34,22.86 v1(29.34,21.84) ; v1(31.55,21.89) 31.55,20.36 32,19.91 USB3301.17 ; U7.57 12.8,18.54 v1(20.7,18.54)
  Bottom Layer w0.254: v1(22.1,18.54) v1(20.7,18.54)
  Bottom Layer w0.381: v1(29.34,21.84) 29.39,21.89 v1(31.55,21.89)
USB-DIR: length 34.5
  Top Layer w0.254: U7.10 19.25,13.09 19.25,13.24 19.18,13.31 v1(19.18,15.93) ; v1(37.29,25.09) 37.73,24.65 USB3301.12
  Bottom Layer w0.254: v1(37.29,25.09) 33.35,25.09 33.02,24.77 33.02,16.18 32.77,15.93 v1(19.18,15.93)
USB-NXT: length 43
  Top Layer w0.254: U7.11 19.79,15.07 v1(20.07,15.34) ; v1(38.23,25.15) USB3301.11
  Bottom Layer w0.254: v1(20.07,15.34) 20.11,15.3 33.2,15.3 33.53,15.62 33.53,22.86 33.91,23.24 36,23.24 36.02,23.23 36.5,23.23 36.51,23.24 42.29,23.24 42.67,23.62 42.67,24.89 42.42,25.15 v1(38.23,25.15)
USB-STP: length 36
  Top Layer w0.254: v1(36.45,25.91) 36.45,24.78 37.23,24 USB3301.13 ; U7.8 18.29,15.24
  Bottom Layer w0.254: v1(18.29,15.24) 18.29,16.13 18.67,16.51 28.32,16.51 28.65,16.84 28.65,25.6 28.96,25.91 v1(36.45,25.91)
USBC1_CC1: length 2.5
  Top Layer w0.254: USBC2.A5 R14.1
USBC1_CC2: length 2.5
  Top Layer w0.254: USBC2.B5 R15.1
XI: length 10.1
  Top Layer w0.254: USB3301.28 37.23,11.91 R23.2 37.71,10.68 37.97,10.41 37.97,9.79 C23.2 37.96,7.91 X4.1
XO: length 10.1
  Top Layer w0.254: USB3301.27 36.73,11.95 R23.1 36.2,10.68 35.94,10.41 35.94,9.79 C24.2 35.95,7.91 X4.2
$1N10874: length 2.6
  Top Layer w0.254: R18.1 10.45,17.05 U7.60
$1N11009: length 3.2
  Top Layer w0.254: 27.43,22.16 27.32,22.05 U7.31
$1N13824: length 2.5
  Top Layer w0.254: C30.1 15.29,27.04 U7.47
$2N2860: length 1.7
  Top Layer w0.254: USB3301.4 R24.2
$2N7992: length 4.3
  Top Layer w0.254: USB3301.32 39.23,15 39.37,14.86 41.53,14.86 41.79,14.6 R22.1
$2N8222: length 1.9
  Top Layer w0.381: R12.2 LED5.2

## Copper pours and planes (outline as drawn; the poured copper is in the pictures)
+3.3V on Top Layer: 45.08,36.58 45.08,32.77 46.09,32.77 46.09,26.93 46.1,26.92 48.4,26.92 48.4,32.77 50.04,32.77 50.04,36.58
+3.3V on Top Layer: 38.2,35.4 45.34,35.4 45.34,33.66 38.2,33.66
GND on Top Layer: -14.99,40.89 70.99,40.89 70.99,-6.22 -14.99,-6.22
GND on Bottom Layer: -10.29,42.16 70.99,42.16 70.99,-5.59 -10.29,-5.59
VCC+5V on Top Layer: 53.88,22.43 51.97,22.43 51.43,22.97 51.43,30.48 49.11,30.48 49.11,22.22 51.18,22.22 51.76,21.64 53.88,21.64
VCC+5V on Top Layer: 52.32,17.65 55.24,17.65 55.24,21.62 55.21,21.62 55.12,21.72 52.08,21.72 52.08,22.43 53.94,22.43 54.27,22.1 56.01,22.1 56.01,17.27 53.98,17.27 53.98,16.89 52.29,16.89 52.29,17.62

Small or netless copper shapes (teardrops, artwork), in the pictures only: 264 on Top Layer, 60 on Bottom Layer
